# EAGLE schematic Main Wiring Harness (EAGLE 7.7.0)
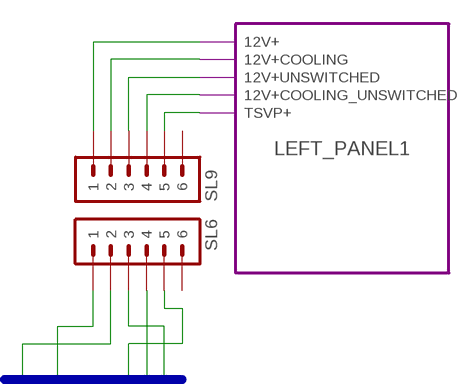
[diagram p0: schematic, sheet 1, part 1 of 3]
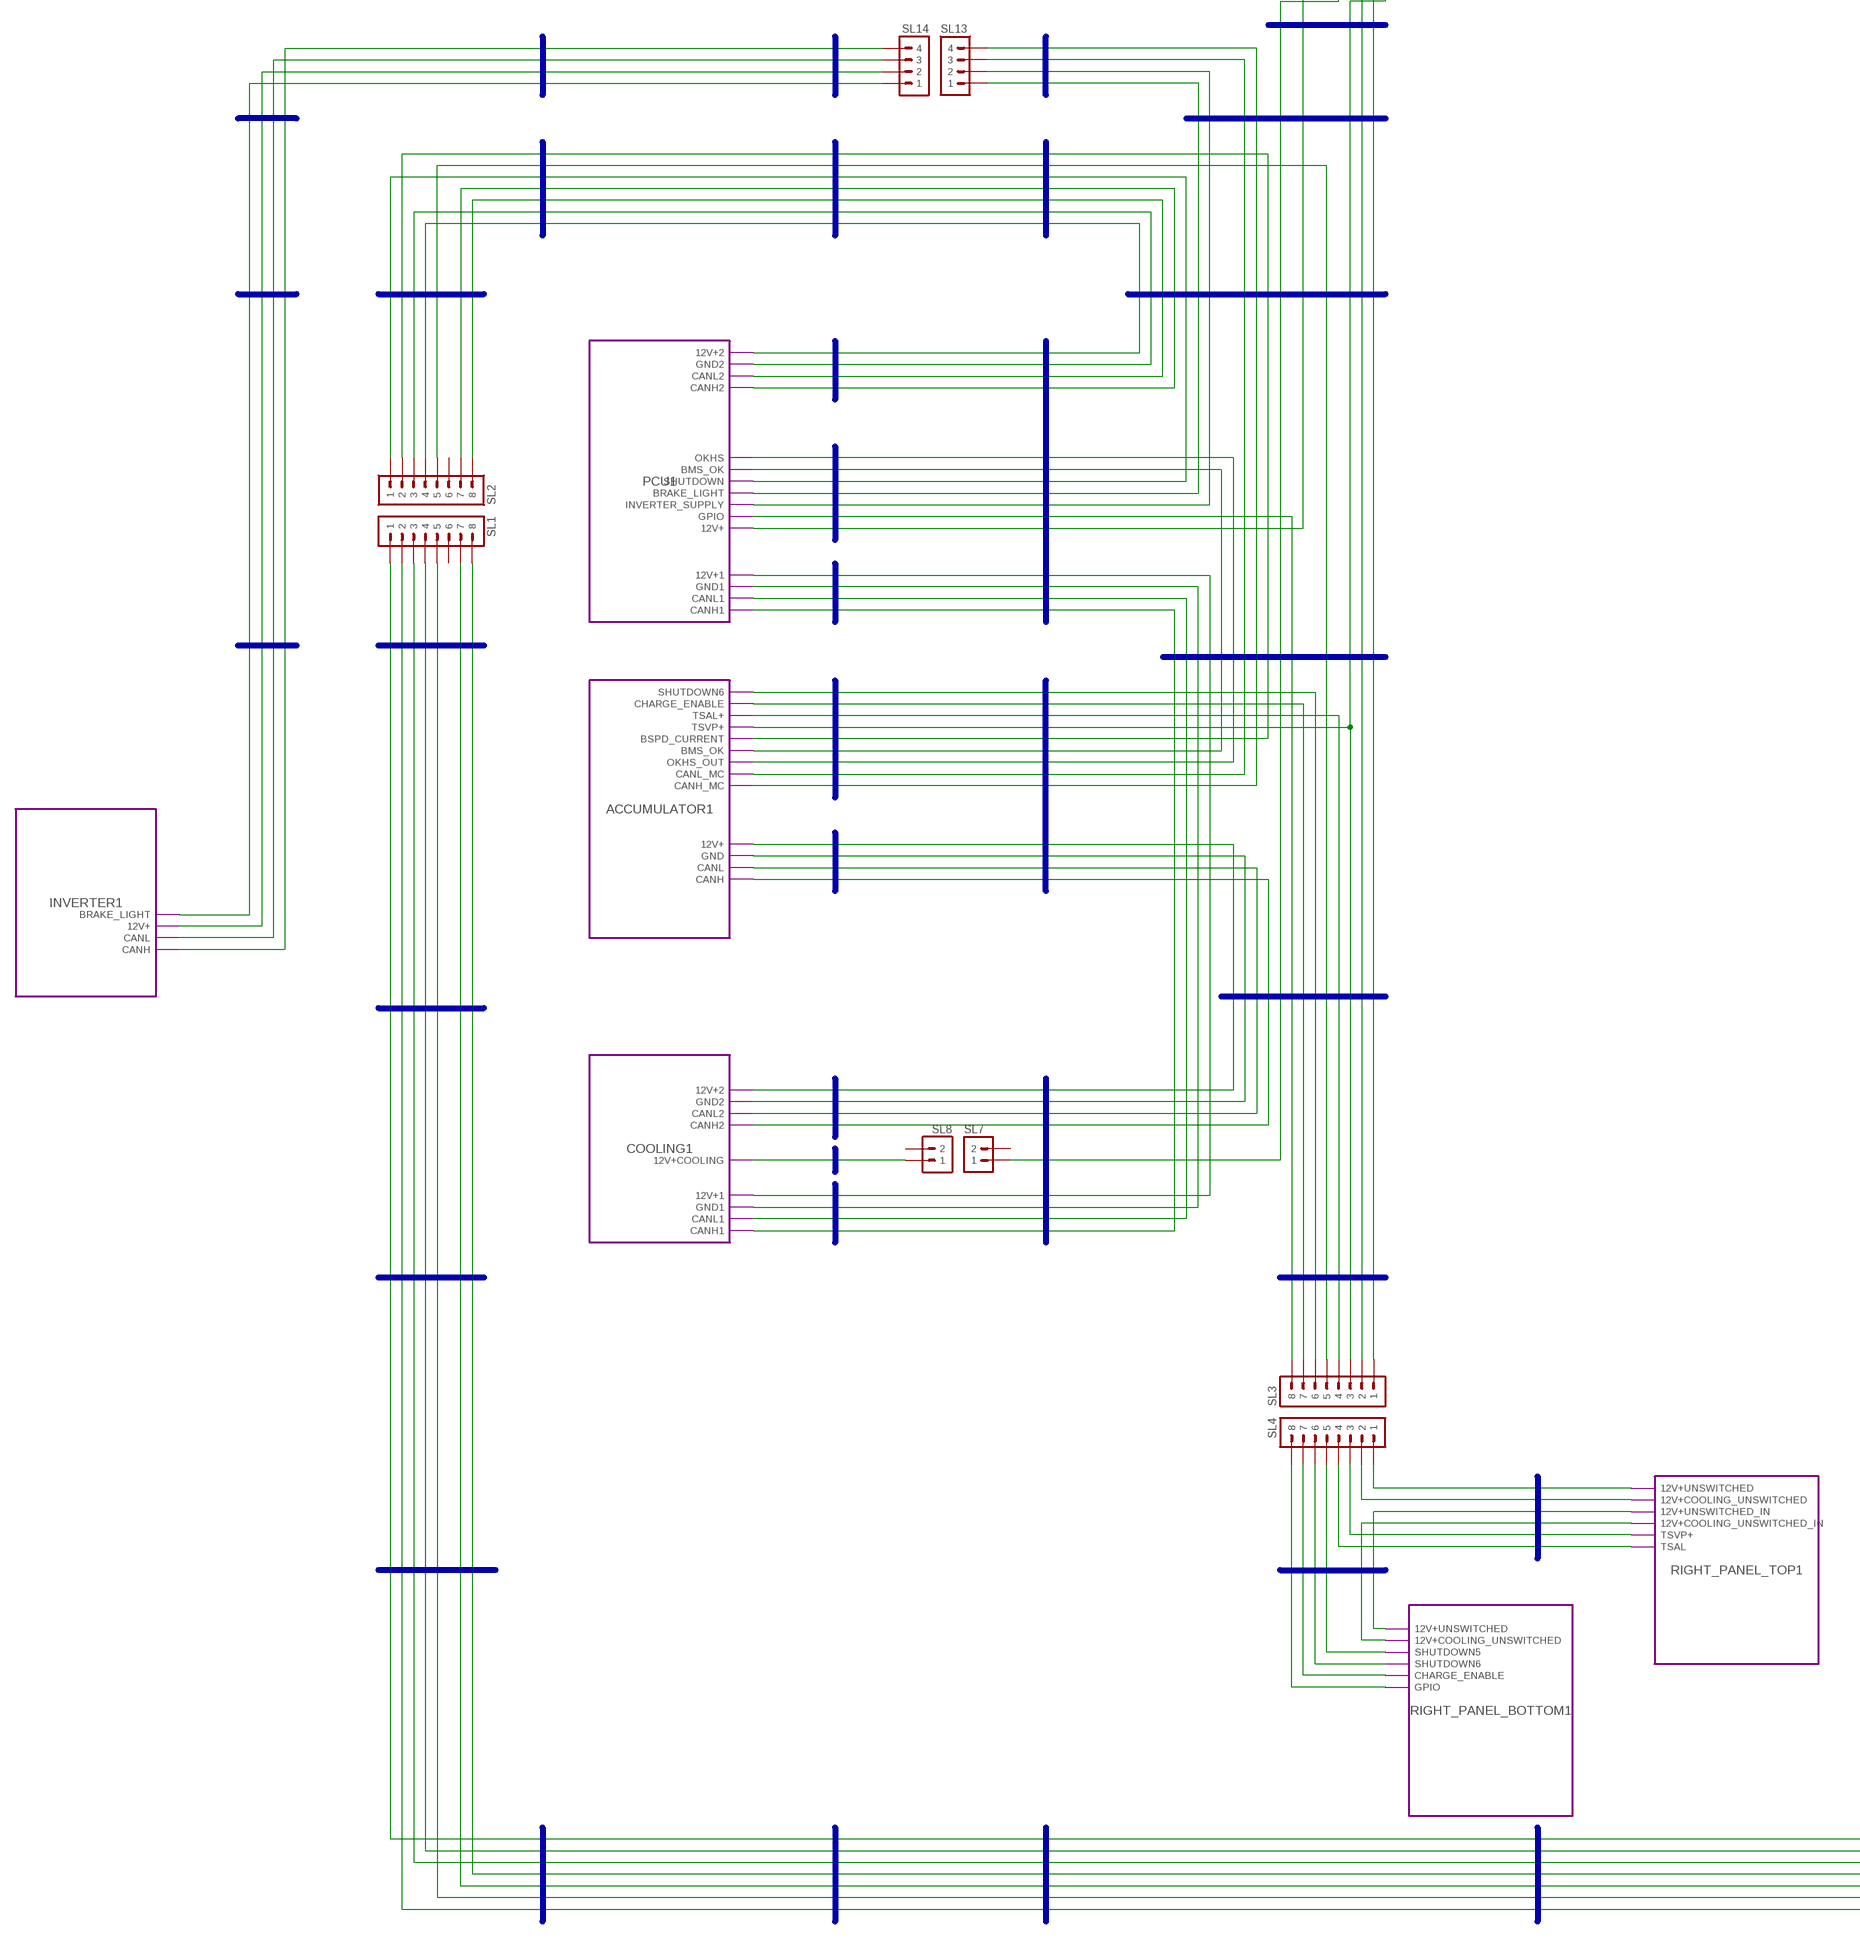
[diagram p1: schematic, sheet 1, part 2 of 3]
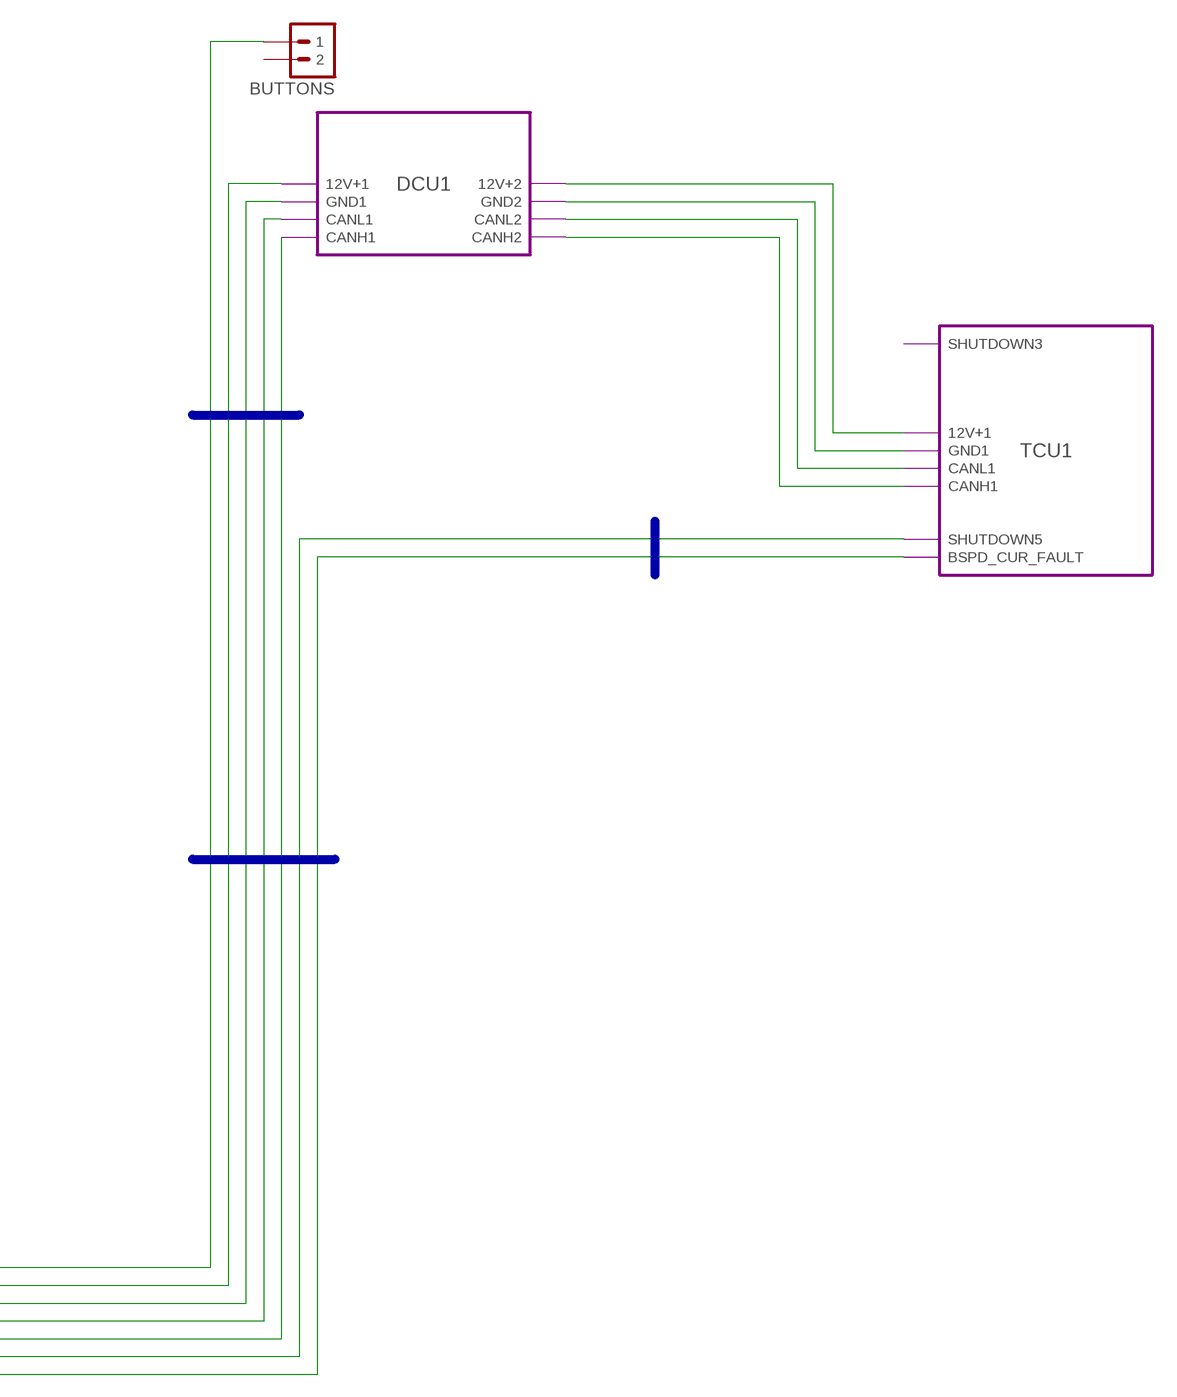
[diagram p2: schematic, sheet 1, part 3 of 3]

## Parts
BUTTONS  M02  (no package)
SL1  M08  (no package)
SL2  M08  (no package)
SL3  M08  (no package)
SL4  M08  (no package)
SL6  M06  (no package)
SL7  M02  (no package)
SL8  M02  (no package)
SL9  M06  (no package)
SL13  M04  (no package)
SL14  M04  (no package)

## Module instances
ACCUMULATOR1 = ACCUMULATOR
PCU1 = PCU
TCU1 = TCU
DCU1 = DCU
COOLING1 = COOLING
INVERTER1 = INVERTER
LEFT_PANEL1 = LEFT_PANEL
RIGHT_PANEL_BOTTOM1 = RIGHT_PANEL_BOTTOM
RIGHT_PANEL_TOP1 = RIGHT_PANEL_TOP

## Nets
N$1: port PCU1.12V+1 COOLING1.12V+1
N$2: port COOLING1.CANH1 PCU1.CANH1
N$3: port PCU1.CANL1 COOLING1.CANL1
N$4: port COOLING1.GND1 PCU1.GND1
N$5: port ACCUMULATOR1.12V+ COOLING1.12V+2
N$6: port ACCUMULATOR1.GND COOLING1.GND2
N$7: port ACCUMULATOR1.CANL COOLING1.CANL2
N$8: port ACCUMULATOR1.CANH COOLING1.CANH2
N$9: SL14.1 ; port INVERTER1.BRAKE_LIGHT
N$10: SL14.2 ; port INVERTER1.12V+
N$11: SL14.3 ; port INVERTER1.CANL
N$12: SL14.4 ; port INVERTER1.CANH
N$13: SL6.1 ; port PCU1.12V+
N$14: SL6.2 SL7.1
N$15: SL4.4 ; port RIGHT_PANEL_TOP1.TSAL
N$16: SL4.1 ; port RIGHT_PANEL_TOP1.12V+UNSWITCHED
N$17: SL8.1 ; port COOLING1.12V+COOLING
N$18: SL4.2 ; port RIGHT_PANEL_TOP1.12V+COOLING_UNSWITCHED
N$19: SL2.3 ; port PCU1.GND2
N$20: port ACCUMULATOR1.OKHS_OUT PCU1.OKHS
N$21: SL4.3 ; port RIGHT_PANEL_TOP1.TSVP+
N$22: port DCU1.12V+2 TCU1.12V+1
N$23: port DCU1.GND2 TCU1.GND1
N$24: port DCU1.CANL2 TCU1.CANL1
N$25: port DCU1.CANH2 TCU1.CANH1
N$27: SL1.2 ; port TCU1.BSPD_CUR_FAULT
N$28: BUTTONS.1 SL1.1
N$29: SL1.7 ; port DCU1.CANH1
N$30: SL1.8 ; port DCU1.CANL1
N$31: SL1.3 ; port DCU1.GND1
N$32: SL1.4 ; port DCU1.12V+1
N$33: SL2.4 ; port PCU1.12V+2
N$34: SL2.7 ; port PCU1.CANH2
N$35: SL2.8 ; port PCU1.CANL2
N$36: SL1.5 ; port TCU1.SHUTDOWN5
N$37: SL2.1 ; port PCU1.SHUTDOWN
N$40: SL3.8 ; port PCU1.GPIO
N$42: SL2.2 ; port ACCUMULATOR1.BSPD_CURRENT
N$43: port RIGHT_PANEL_TOP1.12V+COOLING_UNSWITCHED_IN RIGHT_PANEL_BOTTOM1.12V+COOLING_UNSWITCHED
N$45: SL3.2 SL6.4
N$46: port RIGHT_PANEL_TOP1.12V+UNSWITCHED_IN RIGHT_PANEL_BOTTOM1.12V+UNSWITCHED
N$47: SL3.1 SL6.3
N$48: SL4.5 ; port RIGHT_PANEL_BOTTOM1.SHUTDOWN5
N$49: SL4.6 ; port RIGHT_PANEL_BOTTOM1.SHUTDOWN6
N$50: SL4.7 ; port RIGHT_PANEL_BOTTOM1.CHARGE_ENABLE
N$52: SL4.8 ; port RIGHT_PANEL_BOTTOM1.GPIO
N$53: port PCU1.BMS_OK ACCUMULATOR1.BMS_OK
N$55: SL2.5 SL3.5
N$58: SL13.2 ; port PCU1.INVERTER_SUPPLY
N$62: SL13.3 ; port ACCUMULATOR1.CANL_MC
N$66: SL3.3 SL6.5 ; port ACCUMULATOR1.TSVP+
N$68: SL3.7 ; port ACCUMULATOR1.CHARGE_ENABLE
N$69: SL3.6 ; port ACCUMULATOR1.SHUTDOWN6
N$70: SL9.1 ; port LEFT_PANEL1.12V+
N$71: SL9.2 ; port LEFT_PANEL1.12V+COOLING
N$72: SL9.4 ; port LEFT_PANEL1.12V+COOLING_UNSWITCHED
N$73: SL9.3 ; port LEFT_PANEL1.12V+UNSWITCHED
N$74: SL9.5 ; port LEFT_PANEL1.TSVP+
N$75: SL13.4 ; port ACCUMULATOR1.CANH_MC
N$78: SL13.1 ; port PCU1.BRAKE_LIGHT
N$79: SL3.4 ; port ACCUMULATOR1.TSAL+
Unconnected: BUTTONS.2 SL1.6 SL2.6 SL6.6 SL7.2 SL8.2 SL9.6

## Buses
B$1
B$2
B$3
B$4
B$5
B$6
B$8
B$9
B$10
B$7
B$11
B$13
B$14
B$15
B$16
B$17
B$18
B$19
B$20
B$21
B$22
B$23
B$24
B$25
B$26
B$27
B$28
B$29
B$30
B$31
B$32
B$33
B$34
B$35
B$36
B$37
B$12
B$38
B$39
B$40

## Library data of the parts
BUTTONS SL7 SL8 = HyTechSymbols:M02: Generic 2-pin connector
SL1-SL4 = HyTechSymbols:M08: Generic 8-pin connector
SL6 SL9 = HyTechSymbols:M06: Generic 6-pin connector
SL13 SL14 = HyTechSymbols:M04: Generic 4-pin connector

## Module ACCUMULATOR
Ports: SHUTDOWN6(in) CHARGE_ENABLE(out) TSAL+(out) TSVP+(out) BSPD_CURRENT(out) BMS_OK(out) OKHS_OUT(out) CANL_MC(io) CANH_MC(io) CANL(io) CANH(io) 12V+(in) GND(out)

### Library data of the parts

## Module PCU
Ports: OKHS(in) BMS_OK(in) SHUTDOWN(out) BRAKE_LIGHT(out) INVERTER_SUPPLY(out) 12V+(in) 12V+1(out) GND1(in) CANL1(io) CANH1(io) GND2(in) 12V+2(out) CANL2(io) CANH2(io) GPIO(io)

### Library data of the parts

## Module TCU
Ports: CANH1(io) CANL1(io) 12V+1(in) GND1(out) SHUTDOWN5(out) BSPD_CUR_FAULT(in) SHUTDOWN3(in)

### Library data of the parts

## Module DCU
Ports: GND1(out) 12V+2(out) 12V+1(in) GND2(in) CANL1(io) CANH1(io) CANL2(io) CANH2(io)

### Library data of the parts

## Module COOLING
Ports: GND1(out) 12V+1(in) CANH1(io) CANL1(io) CANL2(io) CANH2(io) 12V+2(out) GND2(in) 12V+COOLING(in)

### Library data of the parts

## Module INVERTER
Ports: CANL(io) CANH(io) 12V+(in) BRAKE_LIGHT(in)

### Library data of the parts

## Module LEFT_PANEL
Ports: TSVP+(in) 12V+COOLING_UNSWITCHED(in) 12V+UNSWITCHED(in) 12V+(out) 12V+COOLING(out)

### Library data of the parts

## Module RIGHT_PANEL_BOTTOM
Ports: SHUTDOWN5(in) SHUTDOWN6(out) CHARGE_ENABLE(in) GPIO(io) 12V+COOLING_UNSWITCHED(out) 12V+UNSWITCHED(out)

### Library data of the parts

## Module RIGHT_PANEL_TOP
Ports: TSVP+(in) 12V+COOLING_UNSWITCHED(out) 12V+UNSWITCHED(out) TSAL(in) 12V+COOLING_UNSWITCHED_IN(in) 12V+UNSWITCHED_IN(in)

### Library data of the parts